# Altium schematic sheet DRV8844.SchDoc
size B
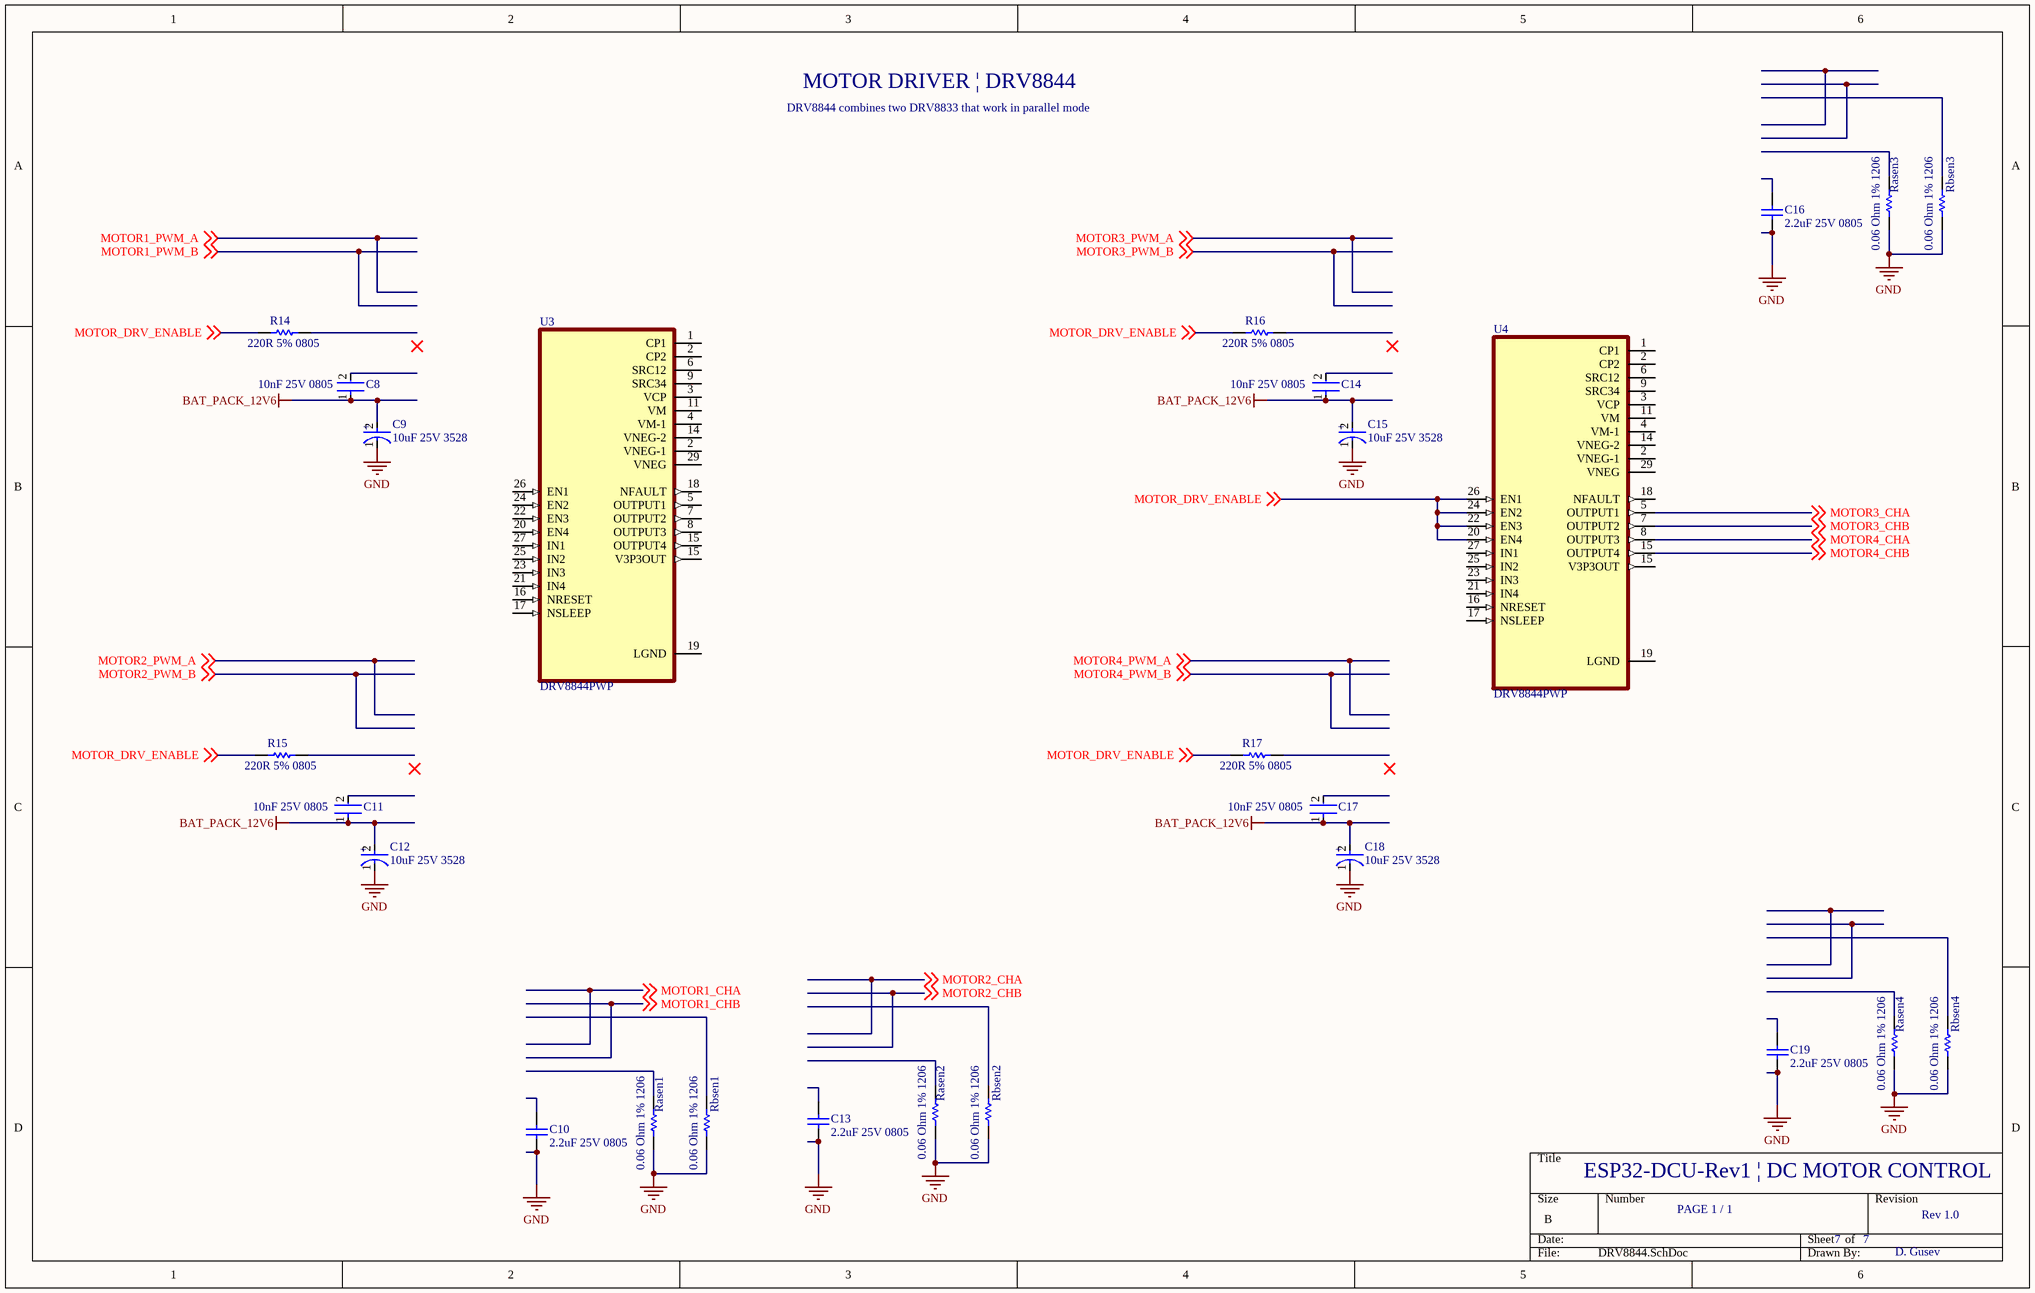
[diagram p0: DRV8844.SchDoc]

## Parts
C8  10nF 25V 0805  [FP-C0805C-DN-MFG]
C9  10uF 25V 3528  [FP-T491B106K025AT-MFG]
C10  2.2uF 25V 0805  [CAPC2013X135X45ML10T25]
C11  10nF 25V 0805  [FP-C0805C-DN-MFG]
C12  10uF 25V 3528  [FP-T491B106K025AT-MFG]
C13  2.2uF 25V 0805  [CAPC2013X135X45ML10T25]
C14  10nF 25V 0805  [FP-C0805C-DN-MFG]
C15  10uF 25V 3528  [FP-T491B106K025AT-MFG]
C16  2.2uF 25V 0805  [CAPC2013X135X45ML10T25]
C17  10nF 25V 0805  [FP-C0805C-DN-MFG]
C18  10uF 25V 3528  [FP-T491B106K025AT-MFG]
C19  2.2uF 25V 0805  [CAPC2013X135X45ML10T25]
R14  220R 5% 0805  [RESC2013X60X40NL20T25]
R15  220R 5% 0805  [RESC2013X60X40NL20T25]
R16  220R 5% 0805  [RESC2013X60X40NL20T25]
R17  220R 5% 0805  [RESC2013X60X40NL20T25]
Rasen1  0.06 Ohm 1% 1206  [RESC3216X89X51NL25T25]
Rasen2  0.06 Ohm 1% 1206  [RESC3216X89X51NL25T25]
Rasen3  0.06 Ohm 1% 1206  [RESC3216X89X51NL25T25]
Rasen4  0.06 Ohm 1% 1206  [RESC3216X89X51NL25T25]
Rbsen1  0.06 Ohm 1% 1206  [RESC3216X89X51NL25T25]
Rbsen2  0.06 Ohm 1% 1206  [RESC3216X89X51NL25T25]
Rbsen3  0.06 Ohm 1% 1206  [RESC3216X89X51NL25T25]
Rbsen4  0.06 Ohm 1% 1206  [RESC3216X89X51NL25T25]
U3  DRV8844PWP  [DRV8844]
U4  DRV8844PWP  [DRV8844]

## Nets
BAT_PACK_12V6: C8.1 C9.2(A) C11.1 C12.2(A) C14.1 C15.2(A) C17.1 C18.2(A)
GND: C9.1(C) C10.1 C12.1(C) C13.1 C15.1(C) C16.1 C18.1(C) C19.1 Rasen1.1 Rasen2.1 Rasen3.1 Rasen4.1 Rbsen1.1 Rbsen2.1 Rbsen3.1 Rbsen4.1
MOTOR3_CHA: U4.5(OUTPUT1) ; off-sheet MOTOR3_CHA
MOTOR3_CHB: U4.7(OUTPUT2) ; off-sheet MOTOR3_CHB
MOTOR4_CHA: U4.8(OUTPUT3) ; off-sheet MOTOR4_CHA
MOTOR4_CHB: U4.15(OUTPUT4) ; off-sheet MOTOR4_CHB
MOTOR_DRV_ENABLE: R14.1 R15.1 R16.1 R17.1 U4.20(EN4) U4.22(EN3) U4.24(EN2) U4.26(EN1) ; off-sheet MOTOR_DRV_ENABLE

Not connected (* = marked no-connect by the designer): C8 2; C10 2; C11 2; C13 2; C14 2; C16 2; C17 2; C19 2; R14 2; R15 2; R16 2; R17 2; Rasen1 2; Rasen2 2; Rasen3 2; Rasen4 2; Rbsen1 2; Rbsen2 2; Rbsen3 2; Rbsen4 2; U3 1(CP1) 2(CP2) 3(VCP) 4(VM-1) 5(OUTPUT1) 6(SRC12) 7(OUTPUT2) 8(OUTPUT3) 9(SRC34) 11(VM) 14(VNEG-2) 15(OUTPUT4) 16(NRESET) 17(NSLEEP) 18(NFAULT) 19(LGND) 20(EN4) 21(IN4) 22(EN3) 23(IN3) 24(EN2) 25(IN2) 26(EN1) 27(IN1) 29(VNEG); U4 1(CP1) 2(CP2) 3(VCP) 4(VM-1) 6(SRC12) 9(SRC34) 11(VM) 14(VNEG-2) 16(NRESET) 17(NSLEEP) 18(NFAULT) 19(LGND) 21(IN4) 23(IN3) 25(IN2) 27(IN1) 29(VNEG)

## Notes on the sheet
- MOTOR DRIVER | DRV8844
- DRV8844 combines two DRV8833 that work in parallel mode
- ESP32-DCU-Rev1 | DC MOTOR CONTROL
- PAGE 1 / 1
- 7
- Rev 1.0
- D. Gusev
- (in symbol CMP-03017-000036-1) +

## Library data of the parts
C8 C11 C14 C17 = CMP-2007-00493-2: CAP CER 10000PF 25V 5% NP0 0805; Manufacturer: KEMET; Manufacturer Part Number: C0805C103J3GACTU; Capacitance: 10,000 pF; Tolerance: 0.05; Value: 10,000 pF; Material: Ceramic; Temperature Characteristic: C0G; Temperature Coefficient: 30ppm/°C; Octopart: https://octopart.com/c0805c103j3gactu-kemet-12563663; Lead Free: Yes; RoHS: TRUE; Package: C0805C-DN; Voltage Rating: 25 V; Ipc Land Pattern Name: CAPC200125X78; ComponentLink2URL: https://content.kemet.com/datasheets/KEM_C1003_C0G_SMD.pdf; Device Class L1: Passive Components; Category: Cap; ComponentLink2Description: Datasheet; Temperature Range High: +125°C; Height: 0.88mm; Temperature Range Low: -55°C; Device Class L3: Ceramic Capacitors; Digikey Description: CAP CER 10000PF 25V 5% NP0 0805; Device Class L2: Capacitors; Mouser Description: Multilayer Ceramic Capacitors MLCC - SMD/SMT 25volts 10000pF 5% C0G; Temperature: -55°C to +125°C; Automotive: No
C9 C12 C15 C18 = CMP-03017-000036-1: CAP TANT 10UF 10% 25V 1411; Life (Hours): 2000Hour; Leakage Current: 2.5uA; ESR (Equivalent Series Resistance): 3R; Ripple Current: 168mA; Polarity: Polar; Dielectric Material: Tantalum; Dissipation Factor: 8%; Package Quantity: 1; Series: T491; Features: General Purpose; Lead Free: Lead Free; Termination: SMD/SMT; Packaging: Tape and Reel; Max Operating Temperature: 125°C; Number of Pins: 2; Case Code (Imperial): 1411; Height - Seated (Max): 0.083inch; Min Operating Temperature: -55°C; Case/Package: 1411; Voltage: 25V; Tolerance: 10%; REACH SVHC: No SVHC; Case Code (Metric): 3528; Depth: 2.8mm; Mount: Surface Mount; Voltage Rating (DC): 25V; Length: 3.5mm; Voltage Rating: 25V; Capacitance: 10uF; Construction: Flat; RoHS Compliant: Yes; Height: 1.9mm; Width: 0.11inch; Radiation Hardening: No
C10 C13 C16 C19 = CMP-2007-03522-1: Part Number: GRM21BF51E225ZA01L; Manufacturer: Murata
R14-R17 = CMP-2001-00612-1: Manufacturer: Panasonic; Part Number: ERA6AEB221V
Rasen1-Rasen4 Rbsen1-Rbsen4 = CMP-2003-04364-1: Manufacturer: Vishay Dale; Part Number: WSL1206R0600FEA
U3 U4 = DRV8844PWP: 60-V, 2.5-A dual H-bridge motor driver with bipolar (+/-30v) supply & independent 1/2-bridge control 28-HTSSOP -40 to 125; MF: Texas Instruments; Value: *; Mouser-Purchase-URL: https://snapeda.com/shop?store=Mouser&id=494013; Package: HTSSOP-28 Texas Instruments; DigiKey-Purchase-URL: https://snapeda.com/shop?store=DigiKey&id=494013; Arrow_Electronics-Purchase-URL: https://snapeda.com/shop?store=Arrow+Electronics&id=494013; MP: DRV8844PWP; Price: None; Availability: Good; SnapEDA_Link: https://www.snapeda.com/parts/DRV8844PWP/Texas%20Instruments/view-part/494013/?ref=snap; Texas_Instruments-Purchase-URL: https://snapeda.com/shop?store=Texas+Instruments&id=494013